# Altium schematic sheet Sheet1.SchDoc
size A3; SheetNumber: 1; SheetTotal: 1; SPICEModelCacheWAHVFVNY: <root> / <DocumentId>WAHVFVNY</DocumentId> / <CacheFrame Number="0"> / <Model Name="led1" Kind="MDL"> / <Text>*Typ RED GaAs LED: Vf=1.7V Vr=4V If=40mA trr=3uS / *LED Pinout: 1=A, 2=K / .MODEL LED1 D (IS=93.2P RS=42M N=3.73 BV=4 IBV=10U / + CJO=2.97P VJ=.75 M=.333 TT=4.32U)</Text> / </Model> / </CacheFrame> / </root>
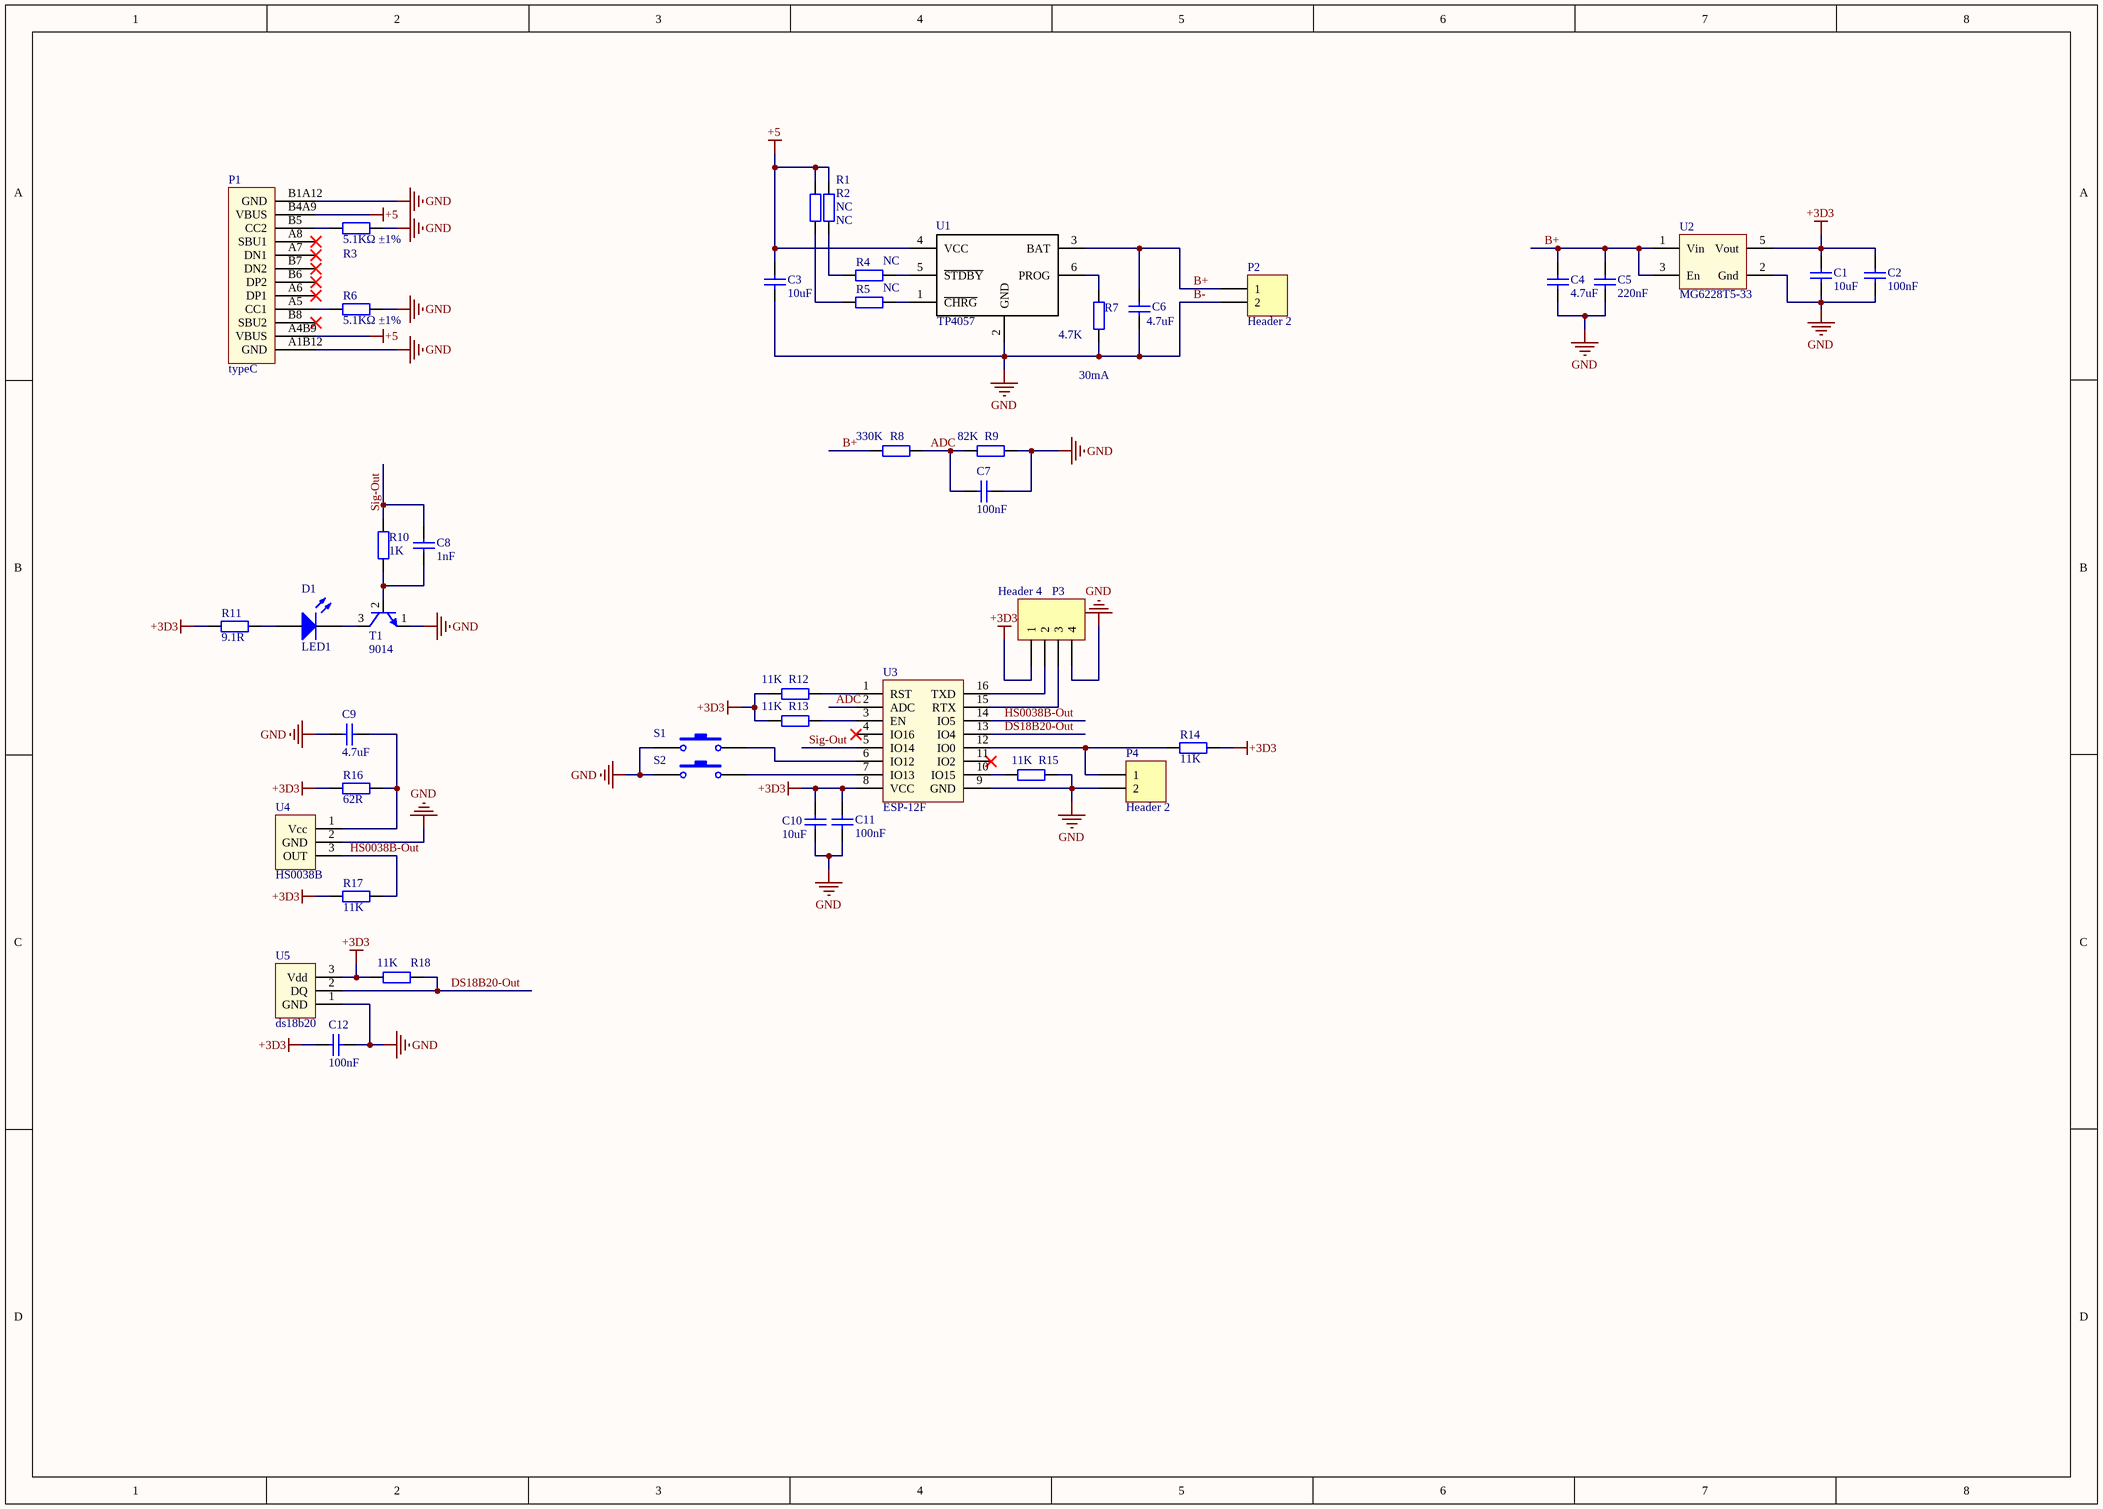
[diagram p0: Sheet1.SchDoc]

## Parts
C1  10uF  [0603_C]
C2  100nF  [0603_C]
C3  10uF  [0603_C]
C4  4.7uF  [0603_C]
C5  220nF  [0603_C]
C6  4.7uF  [0603_C]
C7  100nF  [0603_C]
C8  1nF  [0603_C]
C9  4.7uF  [0603_C]
C10  10uF  [0603_C]
C11  100nF  [0603_C]
C12  100nF  [0603_C]
D1  LED1  [LED-1]
P1  typeC  [USB_C_M]
P2  Header 2  [CR2450]
P3  Header 4  [HDR1X4]
P4  Header 2  [HDR1X2]
R1  NC  [0603_R]
R2  NC  [0603_R]
R3  5.1KΩ ±1%  [0603_R]
R4  NC  [0603_R]
R5  NC  [0603_R]
R6  5.1KΩ ±1%  [0603_R]
R7  4.7K  [0603_R]
R8  330K  [0603_R]
R9  82K  [0603_R]
R10  1K  [0603_R]
R11  9.1R  [0603_R]
R12  11K  [0603_R]
R13  11K  [0603_R]
R14  11K  [0603_R]
R15  11K  [0603_R]
R16  62R  [0603_R]
R17  11K  [0603_R]
R18  11K  [0603_R]
S1  SW-PB  [6x6-key]  (value not drawn)
S2  SW-PB  [6x6-key]  (value not drawn)
T1  9014  [TO-92]
U1  TP4057  [SOT-23-6]
U2  MG6228T5-33  [SOT-23-5]
U3  ESP-12F  [ESP-12F-16Pin]
U4  HS0038B  [HS0038B]
U5  ds18b20  [TO-92]

## Nets
+3D3: C1.2 C2.2 C10.2 C11.2 C12.2 P3.1 R11.1 R12.1 R13.1 R14.1 R16.2 R17.2 R18.2 U2.5(Vout) U3.8(VCC) U5.3(Vdd)
+5: C3.2 P1.A4B9(VBUS) P1.B4A9(VBUS) R1.2 R2.2 U1.4(VCC)
B-: C1.1 C2.1 C3.1 C4.1 C5.1 C6.1 C7.1 C9.2 C10.1 C11.1 C12.1 P1.A1B12(GND) P1.B1A12(GND) P2.2 P3.4 P4.2 R3.1 R6.1 R7.1 R9.2 R15.1 S1.1 S2.1 T1.1(E) U1.2(GND) U2.2(Gnd) U3.9(GND) U4.2(GND) U5.1(GND)  [also labelled GND]
ADC: C7.2 R8.2 R9.1 U3.2(ADC)
B+: C4.2 C5.2 C6.2 P2.1 R8.1 U1.3(BAT) U2.1(Vin) U2.3(En)
DS18B20-Out: R18.1 U3.13(IO4) U5.2(DQ)
HS0038B-Out: R17.1 U3.14(IO5) U4.3(OUT)
Sig-Out: C8.1 R10.2 U3.5(IO14)
NetC8_2: C8.2 R10.1 T1.2(B)
NetC9_1: C9.1 R16.1 U4.1(Vcc)
NetD1_1: D1.1(A) R11.2
NetD1_2: D1.2(K) T1.3(C)
NetP1_A5: P1.A5(CC1) R6.2
NetP1_B5: P1.B5(CC2) R3.2
NetP3_2: P3.2 U3.16(TXD)
NetP3_3: P3.3 U3.15(RTX)
NetP4_1: P4.1 R14.2 U3.12(IO0)
NetR1_1: R1.1 R5.2
NetR2_1: R2.1 R4.1
NetR4_2: R4.2 U1.5(~{STDBY})
NetR5_1: R5.1 U1.1(~{CHRG})
NetR7_2: R7.2 U1.6(PROG)
NetR12_2: R12.2 U3.1(RST)
NetR13_2: R13.2 U3.3(EN)
NetR15_2: R15.2 U3.10(IO15)
NetS1_2: S1.2 U3.6(IO12)
NetS2_2: S2.2 U3.7(IO13)

Not connected (* = marked no-connect by the designer): P1 A6(DP1)* A7(DN1)* A8(SBU1)* B6(DP2)* B7(DN2)* B8(SBU2)*; U3 4(IO16)* 11(IO2)*

## Notes on the sheet
- 30mA

## Library data of the parts
C1 C3 C10 = 0603 10uF (106) 10% 10V: Chip capacitors; Manufacturer: Samsung Electro-Mechanics; PartNumber: CL10A106KP8NNNC; Tolerance: 10%; Voltage: 10V; ComponentLink1Description: Supplier link; ComponentLink1URL: http://www.szlcsc.com/product/details_20411.html; Package: 0603; Supplier: LC; SuppliersPartNumber: C19702; Capacitance: 10uF
C2 C7 C11 = 0603 100nF (104) 10% 50V: Chip capacitors; Manufacturer: YAGEO; PartNumber: CC0603KRX7R9BB104; Tolerance: 10%; Voltage: 50V; ComponentLink1Description: Supplier link; ComponentLink1URL: http://www.szlcsc.com/product/details_15331.html; Package: 0603; Supplier: LC; SuppliersPartNumber: C14663; Capacitance: 100nF
C4 C6 = 0603 4.7uF (475) 10% 16V: Chip capacitors; Manufacturer: Samsung Electro-Mechanics; PartNumber: CL10A475KO8NNNC; Tolerance: 10%; Voltage: 16V; ComponentLink1Description: Supplier link; ComponentLink1URL: http://www.szlcsc.com/product/details_20375.html; Package: 0603; Supplier: LC; SuppliersPartNumber: C19666; Capacitance: 4.7uF
C5 = 0603 100nF (104) 10% 50V: Chip capacitors; Manufacturer: YAGEO; PartNumber: CC0603KRX7R9BB104; Capacitance: 100nF; Tolerance: 10%; Voltage: 50V; ComponentLink1Description: Supplier link; ComponentLink1URL: http://www.szlcsc.com/product/details_15331.html; Package: 0603; Supplier: LC; SuppliersPartNumber: C14663
C8 C9 C12 = 0603 10uF (106) 10% 10V: Chip capacitors; Manufacturer: Samsung Electro-Mechanics; PartNumber: CL10A106KP8NNNC; Capacitance: 10uF; Tolerance: 10%; Voltage: 10V; ComponentLink1Description: Supplier link; ComponentLink1URL: http://www.szlcsc.com/product/details_20411.html; Package: 0603; Supplier: LC; SuppliersPartNumber: C19702
D1 = LED1: Typical RED GaAs LED; Published: 8-Jun-2000; LatestRevisionDate: 08-Jul-2005; LatestRevisionNote: Mech Layer 1 removed.; PackageReference: LED-1; Publisher: Altium Limited; PackageDescription: LED; 2 Leads
P2 P4 = Header 2: Header, 2-Pin
  P4: LatestRevisionDate: 17-Jul-2002; LatestRevisionNote: Re-released for DXP Platform.; Publisher: Altium Limited
P3 = Header 4: Header, 4-Pin; LatestRevisionDate: 17-Jul-2002; LatestRevisionNote: Re-released for DXP Platform.; Publisher: Altium Limited
R1 R2 R4 R5 = 0603 10K (1002) 1%: Chip resistor; Manufacturer: Uniroyal Elec; PartNumber: 0603WAF1002T5E; Power: 1/10W; Resistance: 10KΩ; Tolerance: 1%; ComponentLink1Description: Supplier link; ComponentLink1URL: http://www.szlcsc.com/product/details_26547.html; Package: 0603; Supplier: LC; SuppliersPartNumber: C25804
R3 R6 = 0603 2.4K (2401) 1%: Chip resistor; Manufacturer: Uniroyal Elec; PartNumber: 0603WAF2401T5E; Power: 1/10W; Resistance: 2.4KΩ; ComponentLink1Description: Supplier link; ComponentLink1URL: http://www.szlcsc.com/product/details_23667.html; Package: 0603; Supplier: LC; SuppliersPartNumber: C22940; Tolerance: 1%
R7-R18 = 0603 2.4K (2401) 1%: Chip resistor; Manufacturer: Uniroyal Elec; PartNumber: 0603WAF2401T5E; Power: 1/10W; Resistance: 2.4KΩ; Tolerance: 1%; ComponentLink1Description: Supplier link; ComponentLink1URL: http://www.szlcsc.com/product/details_23667.html; Package: 0603; Supplier: LC; SuppliersPartNumber: C22940
S1 S2 = SW-PB: Switch; Published: 24-Mar-1999; LatestRevisionDate: 17-Jul-2002; LatestRevisionNote: Re-released for DXP Platform.; PackageReference: SPST-2; Publisher: Altium Limited; PackageDescription: Switch; 2 Leads